# EAGLE design centralBoard (EAGLE 8.4.1)
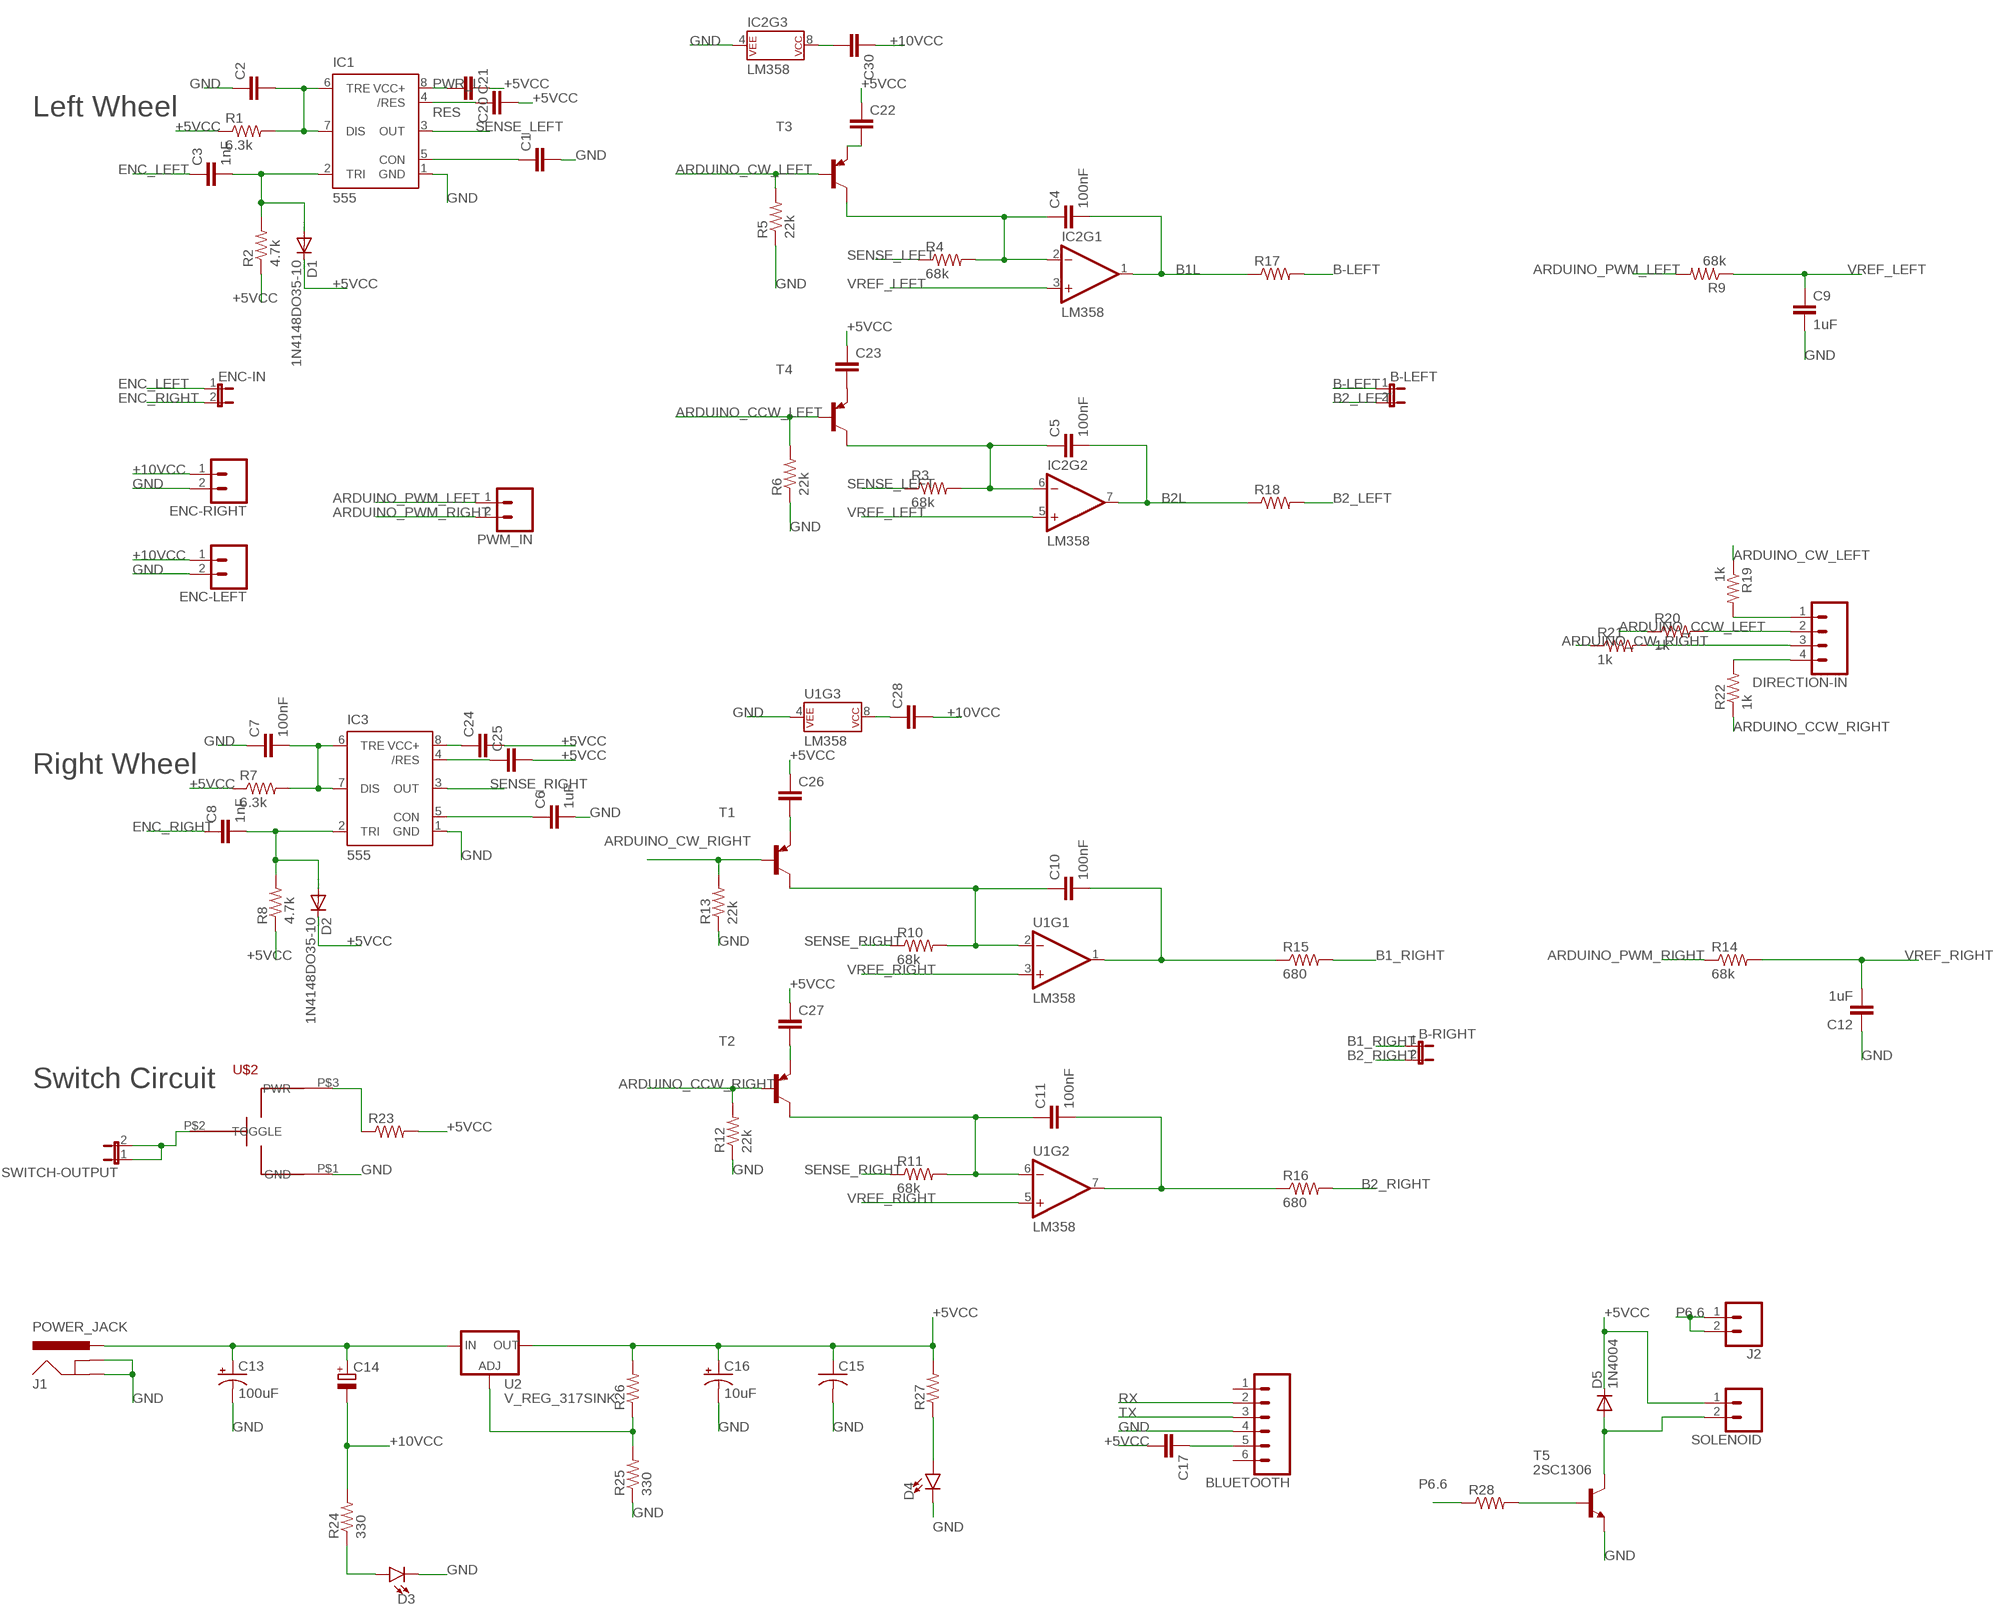
[diagram p0: schematic, sheet 1]

## Parts
B-LEFT  JUMPER-2PTH  [1X02]
B-RIGHT  JUMPER-2PTH  [1X02]
BLUETOOTH  CONN_06SILK_FEMALE_PTH  [1X06]
C1  C5/2.5  [C5B2.5]
C2  C5/2.5  [C5B2.5]
C3  1nF  C5/2.5  [C5B2.5]
C4  100nF  C5/2.5  [C5B2.5]
C5  100nF  C5/2.5  [C5B2.5]
C6  1uF  C5/2.5  [C5B2.5]
C7  100nF  C5/2.5  [C5B2.5]
C8  1nF  C5/2.5  [C5B2.5]
C9  1uF  C5/2.5  [C5B2.5]
C10  100nF  C5/2.5  [C5B2.5]
C11  100nF  C5/2.5  [C5B2.5]
C12  1uF  C5/2.5  [C5B2.5]
C13  100uF  100UF-POLAR-RADIAL-2.5MM-25V-20%  [CPOL-RADIAL-2.5MM-6.5MM]
C14  CPOL-EUE5-6  [E5-6]
C15  C-US050-030X075  [C050-030X075]
C16  10uF  10UF-POLAR-RADIAL-2.5MM-25V-20%  [CPOL-RADIAL-2.5MM-5MM]
C17  C5/3  [C5B3]
C20  C5/2.5  [C5B2.5]
C21  C5/2.5  [C5B2.5]
C22  C5/2.5  [C5B2.5]
C23  C5/2.5  [C5B2.5]
C24  C5/2.5  [C5B2.5]
C25  C5/2.5  [C5B2.5]
C26  C5/2.5  [C5B2.5]
C27  C5/2.5  [C5B2.5]
C28  C5/2.5  [C5B2.5]
C30  C5/2.5  [C5B2.5]
D1  1N4148DO35-10  [DO35-10]
D2  1N4148DO35-10  [DO35-10]
D3  LED-RED1206  [LED-1206]
D4  LED-RED1206  [LED-1206]
D5  1N4004  [DO41-10]
DIRECTION-IN  CONN_04  [1X04]
ENC-IN  JUMPER-2PTH  [1X02]
ENC-LEFT  CONN_02  [1X02]
ENC-RIGHT  CONN_02  [1X02]
IC1  555  555KIT  [DIP08-KIT]
IC2  LM358  [DIP08]
IC3  555  555KIT  [DIP08-KIT]
J1  POWER_JACK  [POWER_JACK_PTH]
J2  CONN_02  [1X02]
PWM_IN  CONN_02LOCK  [1X02_LOCK]
R1  6.3k  R-US_0207/10  [0207/10]
R2  4.7k  R-US_0207/10  [0207/10]
R3  68k  R-US_0207/10  [0207/10]
R4  68k  R-US_0207/10  [0207/10]
R5  22k  R-US_0207/10  [0207/10]
R6  22k  R-US_0207/10  [0207/10]
R7  6.3k  R-US_0207/10  [0207/10]
R8  4.7k  R-US_0207/10  [0207/10]
R9  68k  R-US_0207/10  [0207/10]
R10  68k  R-US_0207/10  [0207/10]
R11  68k  R-US_0207/10  [0207/10]
R12  22k  R-US_0207/10  [0207/10]
R13  22k  R-US_0207/10  [0207/10]
R14  68k  R-US_0207/10  [0207/10]
R15  680  R-US_0207/10  [0207/10]
R16  680  R-US_0207/10  [0207/10]
R17  R-US_0207/10  [0207/10]
R18  R-US_0207/10  [0207/10]
R19  1k  R-US_0207/10  [0207/10]
R20  1k  R-US_0207/10  [0207/10]
R21  1k  R-US_0207/10  [0207/10]
R22  1k  R-US_0207/10  [0207/10]
R23  R-US_0207/10  [0207/10]
R24  330  R-US_0207/10  [0207/10]
R25  330  R-US_0207/10  [0207/10]
R26  R-US_0207/10  [0207/10]
R27  R-US_0207/10  [0207/10]
R28  R-US_0207/10  [0207/10]
SOLENOID  CONN_02  [1X02]
SWITCH-OUTPUT  JUMPER-2PTH  [1X02]
T1  2N4126-PNP-TO92-CBE  [TO92-CBE]
T2  2N4126-PNP-TO92-CBE  [TO92-CBE]
T3  2N4126-PNP-TO92-CBE  [TO92-CBE]
T4  2N4126-PNP-TO92-CBE  [TO92-CBE]
T5  2SC1306  [TO220BV]
U1  LM358  [DIP08]
U2  V_REG_317SINK  [TO220-ADJ]
U$2  SWITCH  [SWITCH]

## Nets
+5VCC: C15.1 C16.1(+) C17.2 C20.1 C21.2 C22.1 C23.1 C24.2 C25.2 C26.1 C27.1 D1.C D2.C D5.C R1.1 R2.1 R7.1 R8.1 R23.2 R26.2 R27.2 SOLENOID.1 U2.OUT
+10VCC: C14.- C28.2 C30.1 ENC-LEFT.1 ENC-RIGHT.1 R24.2
ARDUINO_CCW_LEFT: R6.2 R20.1 T4.B
ARDUINO_CCW_RIGHT: R12.2 R22.1 T2.B
ARDUINO_CW_LEFT: R5.2 R19.1 T3.B
ARDUINO_CW_RIGHT: R13.2 R21.1 T1.B
ARDUINO_PWM_LEFT: PWM_IN.1 R9.2
ARDUINO_PWM_RIGHT: PWM_IN.2 R14.1
B1_RIGHT: B-RIGHT.1 R15.2
B1L: C4.2 IC2.1(OUT) R17.1
B1R: C10.2 R15.1 U1.1(OUT)
B2_LEFT: B-LEFT.2 R18.2
B2_RIGHT: B-RIGHT.2 R16.2
B2L: C5.2 IC2.7(OUT) R18.1
B2R: C11.2 R16.1 U1.7(OUT)
B-LEFT: B-LEFT.1 R17.2
ENC_LEFT: C3.1 ENC-IN.1
ENC_RIGHT: C8.1 ENC-IN.2
GND: BLUETOOTH.4 C1.2 C2.1 C6.2 C7.1 C9.2 C12.1 C13.2(-) C15.2 C16.2(-) D3.C D4.C ENC-LEFT.2 ENC-RIGHT.2 IC1.1(GND) IC2.4(P$V-) IC3.1(GND) J1.GND J1.GNDBREAK R5.1 R6.1 R12.1 R13.1 R25.1 T5.3(E) U1.4(P$V-) U$2.P$1(GND)
N$1: C1.1 IC1.5(CON)
N$2: C22.2 T3.E
N$3: C4.1 IC2.2(-IN) R4.2 T3.C
N$4: C2.2 IC1.6(TRE) IC1.7(DIS) R1.2
N$5: C23.2 T4.E
N$6: C5.1 IC2.6(-IN) R3.2 T4.C
N$7: C3.2 D1.A IC1.2(TRI) R2.2
N$8: C10.1 R10.2 T1.C U1.2(-IN)
N$9: C24.1 IC3.8(VCC+)
N$10: C26.2 T1.E
N$11: C6.1 IC3.5(CON)
N$12: C7.2 IC3.6(TRE) IC3.7(DIS) R7.2
N$13: C8.2 D2.A IC3.2(TRI) R8.2
N$14: C11.1 R11.2 T2.C U1.6(-IN)
N$15: C30.2 IC2.8(P$V+)
N$16: DIRECTION-IN.1 R19.2
N$17: DIRECTION-IN.2 R20.2
N$18: DIRECTION-IN.3 R21.2
N$19: DIRECTION-IN.4 R22.2
N$20: C27.2 T2.E
N$21: C25.1 IC3.4(/RES)
N$22: C13.1(+) C14.+ J1.PWR U2.IN
N$23: R23.1 U$2.P$3(PWR)
N$24: C28.1 U1.8(P$V+)
N$25: D4.A R27.1
N$26: R25.2 R26.1 U2.ADJ
N$27: SWITCH-OUTPUT.1 SWITCH-OUTPUT.2 U$2.P$2(TOGGLE)
N$28: D3.A R24.1
N$29: BLUETOOTH.5 C17.1
N$30: R28.2 T5.1(B)
N$32: D5.A SOLENOID.2 T5.2(C)
P6.6: J2.1 J2.2 R28.1
PWR_L: C20.2 IC1.8(VCC+)
RES: C21.1 IC1.4(/RES)
RX: BLUETOOTH.2
SENSE_LEFT: IC1.3(OUT) R3.1 R4.1
SENSE_RIGHT: IC3.3(OUT) R10.1 R11.1
TX: BLUETOOTH.3
VREF_LEFT: C9.1 IC2.3(+IN) IC2.5(+IN) R9.1
VREF_RIGHT: C12.2 R14.2 U1.3(+IN) U1.5(+IN)
Unconnected: BLUETOOTH.1 BLUETOOTH.6

## Notes on the sheet
- Left Wheel
- Right Wheel
- Switch Circuit

## Library data of the parts
B-LEFT B-RIGHT ENC-IN SWITCH-OUTPUT = SparkFun-Retired:JUMPER-2: Jumper Basic 0.1" spaced jumper. Use with breakaway headers.
BLUETOOTH = SparkFun-Connectors:CONN_06: Multi connection point. Often used as Generic Header-pin footprint for 0.1 inch spaced/style header connections On any of the 0.1 inch spaced packages, you can populate with these: Break Away Headers - Straight <https://www.sparkfun.com/products/116> (PRT-00116) Break Away Male Headers - Right Angle <https://www.sparkfun.com/products/553> (PRT-00553) Female Headers <https://www.sparkfun.com/products/115> (PRT-00115) Break Away Headers - Machine Pin <https://www.sparkfun.com/products/117> (PRT-00117) Break Away Female Headers - Swiss Machine Pin <https://www.sparkfun.com/products/743> (PRT-00743) Arduino Stackable Header - 6 Pin <https://www.sparkfun.com/products/9280> (PRT-09280) For SCREWTERMINALS and SPRING TERMINALS visit here: Screw Terimnals on SparkFun.com <https://www.sparkfun.com/search/results?term=Screw+Terminals> (5mm/3.5mm/2.54mm spacing) This device is also useful as a general connection point to wire up your design to another part of your project. Our various solder wires solder well into these plated through hole pads. Hook-Up Wire - Assortment (Stranded, 22 AWG) <https://www.sparkfun.com/products/11375> (PRT-11375) Hook-Up Wire - Assortment (Solid Core, 22 AWG) <https://www.sparkfun.com/products/11367> (PRT-11367) View the entire wire category on our website here <https://www.sparkfun.com/categories/141>; PROD_ID: CONN-08437
C1-C12 C17 C20-C28 C30 = capacitor-wima:C: CAPACITOR naming: grid - package width
C13 = SparkFun-Capacitors:100UF-POLAR: 100µF polarized capacitors A capacitor is a passive two-terminal electrical component used to store electrical energy temporarily in an electric field.; PROD_ID: CAP-08439
C14 = resistor:CPOL-EU: POLARIZED CAPACITOR, European symbol
C15 = resistor:C-US: CAPACITOR, American symbol
C16 = SparkFun-Capacitors:10UF-POLAR: 10.0µF polarized capacitors A capacitor is a passive two-terminal electrical component used to store electrical energy temporarily in an electric field.; PROD_ID: CAP-08440
D1 D2 = diode:1N4148: DIODE high speed (Philips)
D3 D4 = SparkFun-LED:LED-RED: Red SMD LED Used in manufacturing of most products at SparkFun Packages: 0603 - SMD 0603 package [Product Link] <http://docs.avagotech.com/docs/AV02-0551EN> 0603 SMART - SMD 0603 SMART package ( more efficient and expensive)[Product Link] <http://www.osram-os.com/Graphics/XPic2/00077099_0.pdf> 1206 - SMD1206 package [Product Link] <https://www.sparkfun.com/datasheets/DevTools/LilyPad/Q150OVS4.pdff> SparkFun Products: Pro Mini 328 -5V <https://www.sparkfun.com/products/821> RedBoard <https://www.sparkfun.com/products/12757> IOIO-OTG <https://www.sparkfun.com/products/13613>; PROD_ID: DIO-09912; VALUE: RED
D5 = adafruit:1N4004: DIODE General purpose 1N400x type rectifier (With bigger pads) http://www.ladyada.net/library/pcb/eaglelibrary.html
DIRECTION-IN = SparkFun-Connectors:CONN_04: Multi connection point. Often used as Generic Header-pin footprint for 0.1 inch spaced/style header connections On any of the 0.1 inch spaced packages, you can populate with these: Break Away Headers - Straight <https://www.sparkfun.com/products/116> (PRT-00116) Break Away Male Headers - Right Angle <https://www.sparkfun.com/products/553> (PRT-00553) Female Headers <https://www.sparkfun.com/products/115> (PRT-00115) Break Away Headers - Machine Pin <https://www.sparkfun.com/products/117> (PRT-00117) Break Away Female Headers - Swiss Machine Pin <https://www.sparkfun.com/products/743> (PRT-00743) For SCREWTERMINALS and SPRING TERMINALS visit here: Screw Terimnals on SparkFun.com <https://www.sparkfun.com/search/results?term=Screw+Terminals> (5mm/3.5mm/2.54mm spacing) This device is also useful as a general connection point to wire up your design to another part of your project. Our various solder wires solder well into these plated through hole pads. Hook-Up Wire - Assortment (Stranded, 22 AWG) <https://www.sparkfun.com/products/11375> (PRT-11375) Hook-Up Wire - Assortment (Solid Core, 22 AWG) <https://www.sparkfun.com/products/11367> (PRT-11367) View the entire wire category on our website here <https://www.sparkfun.com/categories/141> Special notes: Molex polarized connector foot print use with SKU : PRT-08231 with associated crimp pins and housings. 1MM SMD Version SKU: PRT-10208; PROD_ID: CONN-09696
ENC-LEFT ENC-RIGHT J2 PWM_IN SOLENOID = SparkFun-Connectors:CONN_02: Multi connection point. Often used as Generic Header-pin footprint for 0.1 inch spaced/style header connections On any of the 0.1 inch spaced packages, you can populate with these: Break Away Headers - Straight <https://www.sparkfun.com/products/116> (PRT-00116) Break Away Male Headers - Right Angle <https://www.sparkfun.com/products/553> (PRT-00553) Female Headers <https://www.sparkfun.com/products/115> (PRT-00115) Break Away Headers - Machine Pin <https://www.sparkfun.com/products/117> (PRT-00117) Break Away Female Headers - Swiss Machine Pin <https://www.sparkfun.com/products/743> (PRT-00743) For SCREWTERMINALS and SPRING TERMINALS visit here: Screw Terimnals on SparkFun.com <https://www.sparkfun.com/search/results?term=Screw+Terminals> (5mm/3.5mm/2.54mm spacing) This device is also useful as a general connection point to wire up your design to another part of your project. Our various solder wires solder well into these plated through hole pads. Hook-Up Wire - Assortment (Stranded, 22 AWG) <https://www.sparkfun.com/products/11375> (PRT-11375) Hook-Up Wire - Assortment (Solid Core, 22 AWG) <https://www.sparkfun.com/products/11367> (PRT-11367) View the entire wire category on our website here <https://www.sparkfun.com/categories/141> Special notes: Molex polarized connector foot print use with: PRT-08233 with associated crimp pins and housings. 2.54_SCREWTERM for use with PRT-10571. 3.5mm Screw Terminal footprints for PRT-08084 5mm Screw Terminal footprints for use with PRT-08432
IC1 IC3 = SparkFun-IC-Special-Function:555: General purpose bipolar Timer Datasheet <http://www.sparkfun.com/datasheets/Components/General/ne555.pdf> SparkFun Products SparkFun SparkPunk Sequencer Kit <https://www.sparkfun.com/products/12707> (KIT-12707) Storefront Component: 555 Timer <https://www.sparkfun.com/products/9273> (COM-09273) Two parts valid for production: VFP: IC-11930 (M7555 PTH) VFP: IC-09173 (555 PTH) - Preferred; PROD_ID: IC-09173; PROD_ID_ALT: IC-11930
IC2 U1 = SparkFun-IC-Amplifiers:LM358: LM358 Jellybean op-amp Datasheet <http://www.sparkfun.com/datasheets/Components/General/LM358.pdf> SparkFun Products Op-Amp (Thru-Hole) - LM358 <https://www.sparkfun.com/products/9456> (COM-09456); PROD_ID: IC-09172
J1 = SparkFun-Connectors:POWER_JACK: Power Jack Connector This is the standard 5.5mm barrel jack for power. The PTH is the most common, proven, reliable, footprint. The Slot footprint only works if the mill layer is transmitted to the PCB fab house so be warned. Here are the connectors we sell at SparkFun: DC Barrel Power Jack/Connector <https://www.sparkfun.com/products/119> (PRT-00119) DC Barrel Power Jack/Connector (SMD) <https://www.sparkfun.com/products/12748> (PRT-12748) DC Barrel Jack Adapter - Breadboard Compatible <https://www.sparkfun.com/products/10811> (PRT-10811) It is used on this SparkFun product (and many, many others): SparkFun RedBoard - Programmed with Arduino <https://www.sparkfun.com/products/12757> (DEV-12757) Also, if you need a mating power supply or connector, please check these out: Wall Adapter Power Supply - 9VDC 650mA <https://www.sparkfun.com/products/298> (TOL-00298) DC Barrel Jack Adapter - Male <https://www.sparkfun.com/products/10287> (PRT-10287); PROD_ID: CONN-08197
R1-R28 = resistor:R-US_: RESISTOR, American symbol
T1-T4 = transistor:*-PNP-: PNP Transistror
T5 = transistor:2SC1306: NPN Transistor Final RF Power Outupt Source: 2sc1306.pdf
U2 = SparkFun-IC-Power:V_REG_317: Voltage Regulator Standard LM317 adjustable voltage regulator. AOI (Adjust Output Input). Google 'LM317 Calculator' for easy to use app to get the two resistor values needed. 240/720 for 5V output. 240/390 for 3.3V output. Spark Fun Electronics SKU : COM-00527
U$2 = mySwitch:SWITCH

## Board
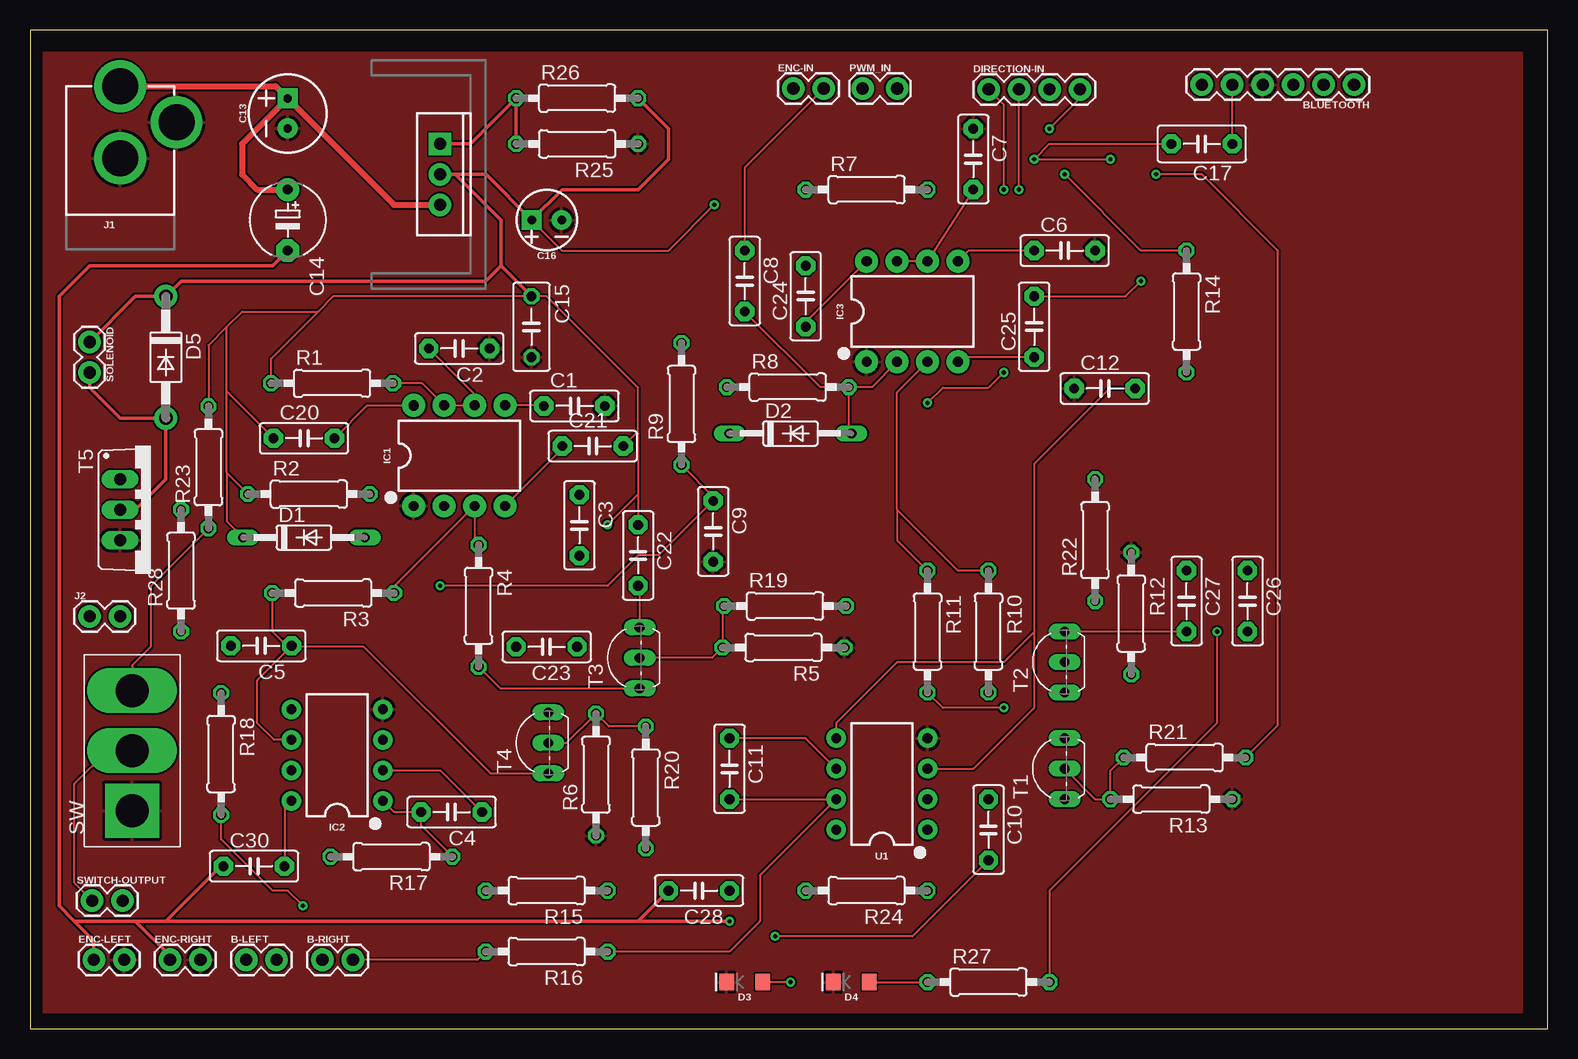
[diagram p1: board, top side]
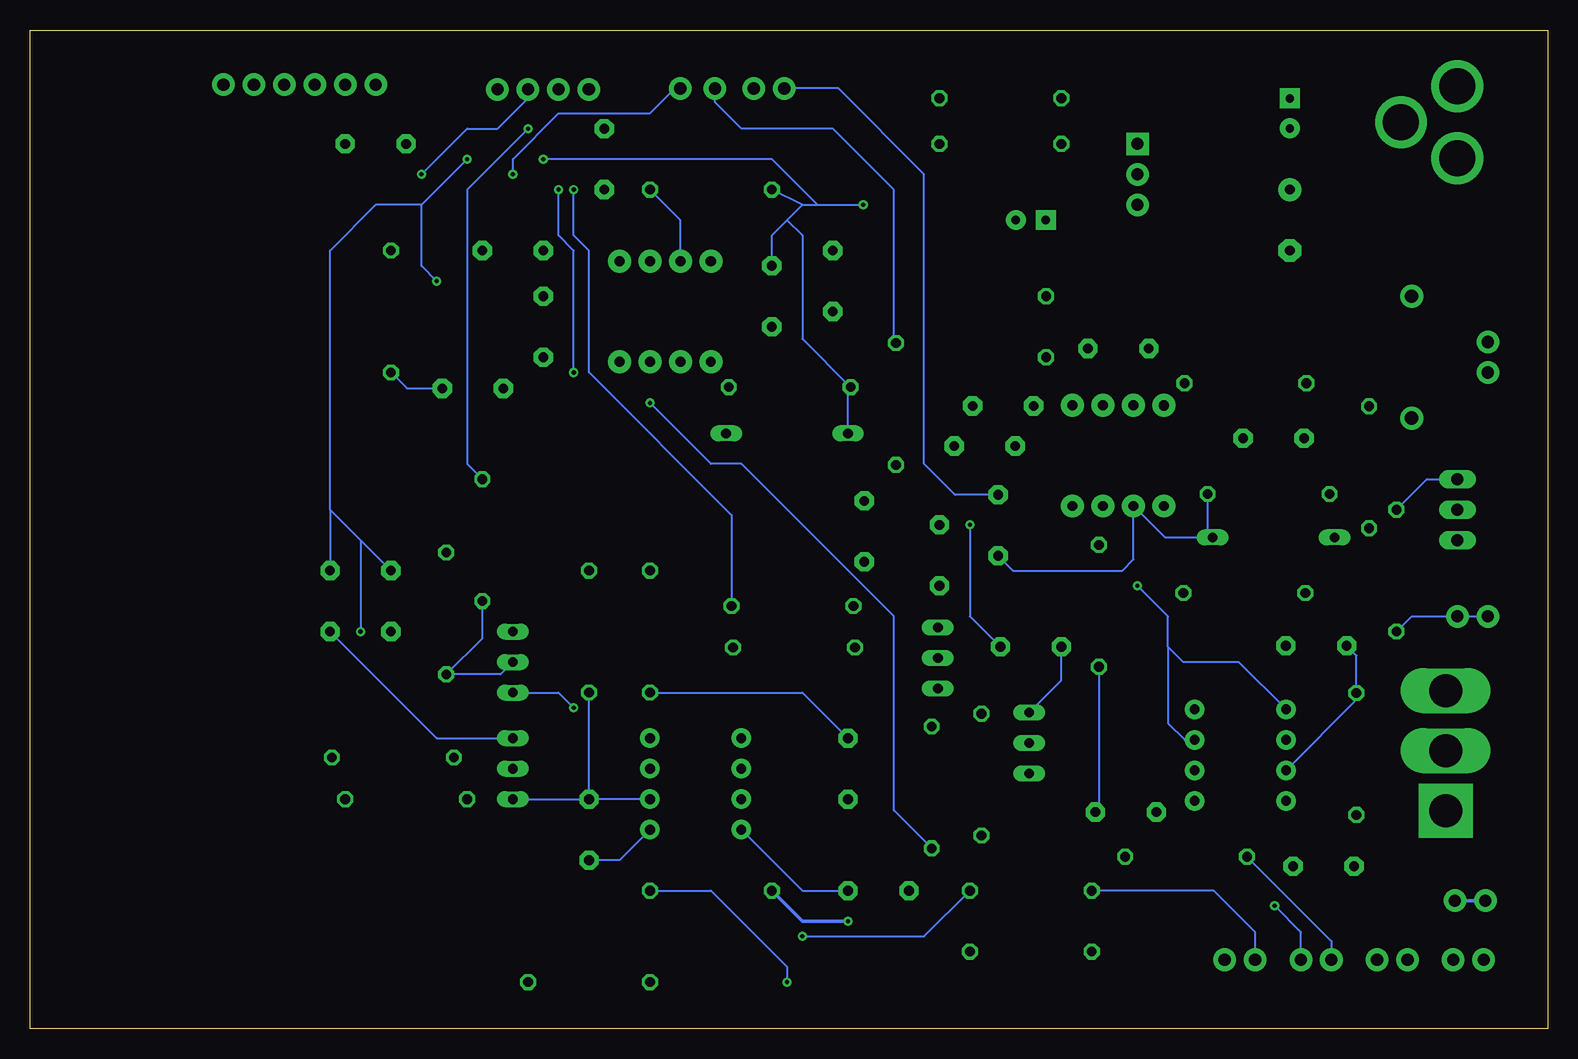
[diagram p2: board, bottom side, seen from below]

Size 126.5 x 83.24 mm. Coordinates in mm from the lower left corner, seen from the top.
Outline: 0,0 126.5,0 126.5,83.24 0,83.24 0,0
Copper layers (1*16): Top 0.035mm / dielectric 1.5mm / Bottom 0.035mm
Design rules "default": minimum track width 6mil, minimum drill 0.35mm, track to track 6mil, track to pad 6mil, pad to pad 6mil, via to via 6mil, smd to smd 6mil, copper to edge 40mil, drill to drill 6mil, minimum pad ring 10mil, minimum via ring 8mil, stop-mask expansion 4mil, vias tented up to drill 0mil, thermal gap 10mil

### Footprints (pad centres in the part's own frame; a part is rotated, then mirrored left to right if it is on the bottom)
1X02 = drill 1.016 pad 1.88: 1 0,0; 2 2.54,0
1X06 = drill 1.016 pad 1.88: 1 0,0; 2 2.54,0; 3 5.08,0; 4 7.62,0; 5 10.16,0; 6 12.7,0
C5B2.5 = drill 0.813 pad 1.6 octagon: 1 -2.54,0; 2 2.54,0
CPOL-RADIAL-2.5MM-6.5MM = drill 0.7 pad 1.651 square: 1 1.25,0 | drill 0.7 pad 1.651: 2 -1.25,0
E5-6 = drill 0.813 pad 1.905: + -2.54,0 | drill 0.813 pad 1.905 octagon: - 2.54,0
C050-030X075 = drill 0.813 octagon: 1 -2.54,0; 2 2.54,0
CPOL-RADIAL-2.5MM-5MM = drill 0.7 pad 1.651 square: 1 1.25,0 | drill 0.7 pad 1.651: 2 -1.25,0
C5B3 = drill 0.813 pad 1.6 octagon: 1 -2.54,0; 2 2.54,0
DO35-10 = drill 0.813 long: A 5.08,0; C -5.08,0
LED-1206 = smd 1.2 x 1.4: A -1.5,0; C 1.5,0
DO41-10 = drill 1.118 pad 1.93: A 5.08,0; C -5.08,0
1X04 = drill 1.016 pad 1.88: 1 0,0; 2 2.54,0; 3 5.08,0; 4 7.62,0
DIP08-KIT = drill 0.813 pad 1.905: 1 -3.81,-4.191; 2 -1.27,-4.191; 3 1.27,-4.191; 4 3.81,-4.191; 5 3.81,4.191; 6 1.27,4.191; 7 -1.27,4.191 | drill 0.864 pad 1.905: 8 -3.81,4.191
DIP08 = drill 0.813 pad 1.626: 1 -3.81,-3.81; 2 -1.27,-3.81; 3 1.27,-3.81; 4 3.81,-3.81; 5 3.81,3.81; 6 1.27,3.81; 7 -1.27,3.81; 8 -3.81,3.81
POWER_JACK_PTH = drill 2.997 pad 4.318: GND 0,7.7; GNDBREAK 4.7,10.7; PWR 0,13.7
1X02_LOCK = drill 1.016 pad 1.88: 1 -0.178,0; 2 2.718,0
0207/10 = drill 0.813 octagon: 1 -5.08,0; 2 5.08,0
TO92-CBE = drill 0.813 long: B 0,0; C -2.54,0; E 2.54,0
TO220BV = drill 1.016 long: 1 -2.54,-2.54; 2 0,-2.54; 3 2.54,-2.54
TO220-ADJ = drill 1 pad 1.88 square: ADJ -2.54,0 | drill 1 pad 1.88: IN 2.54,0; OUT 0,0
SWITCH = drill 2.75 pad 4.5 square: P$1 -13.57,3.23 | drill 2.75 pad 3.25 long: P$2 -8.57,3.23; P$3 -3.57,3.23

### Placement (x,y rotation side)
B-LEFT  18.02,5.76 0 top
B-RIGHT  24.37,5.76 0 top
BLUETOOTH  110.38,78.69 180 top
C1  45.38,51.91 0 top
C2  35.78,56.7 180 top
C3  45.8,41.97 270 top
C4  35.14,18.07 180 top
C5  19.28,31.92 180 top
C6  86.25,64.86 0 top
C7  78.63,72.48 270 top
C8  59.58,62.32 270 top
C9  56.95,41.46 270 top
C10  79.9,16.6 270 top
C11  58.31,21.68 270 top
C12  89.59,53.37 0 top
C13  21.48,76.29 90 top
C14  21.48,67.4 270 top
C15  41.8,58.51 270 top
C16  43.07,67.4 180 top
C17  97.68,73.75 180 top
C20  22.84,49.22 0 top
C21  46.91,48.57 0 top
C22  50.69,39.46 270 top
C23  43.07,31.84 180 top
C24  64.66,61.05 90 top
C25  83.71,58.51 90 top
C26  101.49,35.65 270 top
C27  96.41,35.65 270 top
C28  55.77,11.52 180 top
C30  18.67,13.56 0 top
D1  22.83,40.95 0 top
D2  63.39,49.62 0 top
D3  59.58,3.9 180 top
D4  68.47,3.9 180 top
D5  11.32,55.97 270 top
DIRECTION-IN  79.91,78.29 0 top
ENC-IN  63.63,78.37 0 top
ENC-LEFT  5.32,5.76 0 top
ENC-RIGHT  11.67,5.76 0 top
IC1  35.79,47.77 0 top
IC2  25.6,22.82 90 top
IC3  73.55,59.78 0 top
J1  7.51,64.86 0 top
J2  4.97,34.38 0 top
PWM_IN  69.58,78.37 0 top
R1  25.18,53.8 0 top
R2  23.25,44.57 0 top
R3  25.27,36.32 180 top
R4  37.39,35.25 270 top
R5  62.81,31.78 180 top
R6  47.18,21.19 90 top
R7  69.74,69.94 0 top
R8  63.17,53.48 0 top
R9  54.31,52.08 90 top
R10  79.9,33.11 270 top
R11  74.82,33.11 270 top
R12  91.8,34.62 270 top
R13  95.14,19.14 180 top
R14  96.41,59.78 270 top
R15  43.07,11.52 180 top
R16  43.07,6.44 180 top
R17  30.13,14.35 180 top
R18  15.93,22.91 270 top
R19  62.94,35.24 0 top
R20  51.33,20.12 270 top
R21  96.25,22.61 0 top
R22  88.79,40.73 90 top
R23  14.88,46.8 90 top
R24  69.74,11.52 180 top
R25  45.61,73.75 180 top
R26  45.61,77.56 0 top
R27  79.9,3.9 0 top
R28  12.59,38.19 90 top
SOLENOID  4.97,57.24 270 top
SWITCH-OUTPUT  5.18,10.68 0 top
T1  86.25,21.68 90 top
T2  86.25,30.57 90 top
T3  50.82,30.91 90 top
T4  43.2,23.83 90 top
T5  10.05,43.27 270 top
U1  71.01,20.41 90 top
U2  34.18,71.21 270 top
U$2  11.73,31.75 90 top

### Tracks (layer width: path | path; a pad name or v marks a point on that pad's centre or on a via)
+5VCC  (via drill 0.35)
  Top 0.152: 16.4,58.51 17.67,59.78 24.02,59.78 | R1.1 20.1,55.86 24.02,59.78 | 50.69,49.62 50.69,53.43 43.07,61.05 C15.1 25.29,61.05 24.02,59.78 | 50.69,49.62 50.69,44.54 | 50.69,44.54 C22.1 | C21.2 50.5,49.62 50.69,49.62 | 50.69,44.54 v48.15,42 | C16.1 44.36,64.86 53.23,64.86 v57.04,68.67 | C17.2 84.98,73.75 v83.71,72.48 v90.06,72.48 | C25.2 91.33,61.05 v92.6,62.32 | D1.C 16.4,42.3 16.4,46.34 | 16.4,46.34 16.4,53.12 | 16.4,53.12 16.4,58.51 | R23.2 14.88,56.99 16.4,58.51 | C20.1 16.4,53.12 | R2.1 16.4,46.34 | v98.95,33.11 98.95,25.49 84.98,11.52 R27.2
  Top 0.305: R26.2 53.23,75.02 53.23,72.48 50.69,69.94 44.34,69.94 41.82,67.42 C16.1 38.01,71.21 U2.OUT 35.45,71.21 39.26,67.4 39.26,63.59 | 39.26,63.59 37.99,62.32 12.59,62.32 D5.C 8.78,61.05 SOLENOID.1 | C15.1 39.26,63.59
  Bottom 0.152: C23.1 48.15,34.38 v48.15,42 | 62.12,68.67 60.85,68.67 | 60.85,68.67 v57.04,68.67 | 62.12,68.67 R7.1 | C24.2 64.66,66.13 63.39,67.4 | 63.39,67.4 62.12,68.67 | 63.39,67.4 62.12,66.13 62.12,57.51 R8.1 58.31,53.26 D2.C | 60.85,68.67 64.66,72.48 v83.71,72.48 | 93.87,68.67 v90.06,72.48 | 93.87,68.67 97.68,68.67 101.49,64.86 101.49,43.27 | 101.49,43.27 C26.1 | C27.1 98.95,40.73 | 98.95,40.73 101.49,43.27 | v92.6,62.32 93.87,63.59 93.87,68.67 | 98.95,40.73 v98.95,33.11
+10VCC  (via drill 0.35)
  Top 0.305: C14.- 20.21,63.59 4.97,63.59 2.43,61.05 2.43,10.25 3.7,8.98 | 8.78,8.98 3.7,8.98 | 8.78,8.98 11.32,8.98 | 11.32,8.98 15.9,13.56 C30.1 | 3.7,8.98 5.32,7.36 ENC-LEFT.1 | ENC-RIGHT.1 11.67,6.09 8.78,8.98 | 11.32,8.98 50.69,8.98 | 50.69,8.98 C28.2 | 50.69,8.98 v58.31,8.98
  Bottom 0.305: v58.31,8.98 62.12,8.98 R24.2
ARDUINO_CCW_LEFT
  Top 0.152: R20.1 48.25,25.2 R6.2 44.74,23.83 T4.B
ARDUINO_CCW_RIGHT
  Bottom 0.152: R22.1 88.79,32.55 R12.2 87.28,29.54 T2.B
ARDUINO_CW_LEFT
  Top 0.152: R19.1 57.73,35.11 R5.2 56.86,30.91 T3.B
ARDUINO_CW_RIGHT
  Top 0.152: R21.1 90.06,21.5 R13.2 88.79,19.14 T1.B
ARDUINO_PWM_LEFT
  Bottom 0.152: R9.2 54.5,57.35 54.5,69.94 59.58,75.02 67.2,75.02 69.4,77.22 PWM_IN.1
ARDUINO_PWM_RIGHT  (via drill 0.35)
  Top 0.152: R14.1 92.6,64.86 v86.25,71.21
  Bottom 0.152: v86.25,71.21 86.25,72.48 82.44,76.29 74.82,76.29 72.74,78.37 PWM_IN.2
B1_RIGHT
  Bottom 0.152: B-RIGHT.1 24.37,8.06 27.83,11.52 R15.2
B1L
  Top 0.152: IC2.1 30.35,18.07 C4.2 32.6,16.96 R17.1
B1R  (via drill 0.35)
  Top 0.152: C10.2 73.55,7.71 v62.12,7.71
  Bottom 0.152: U1.1 77.36,14.06 C10.2 | v62.12,7.71 51.96,7.71 R15.1
B2_LEFT  (via drill 0.35)
  Top 0.152: v22.75,10.25 21.48,11.52 20.21,11.52 15.93,15.8 R18.2
  Bottom 0.152: B-LEFT.2 20.56,8.06 v22.75,10.25
B2_RIGHT
  Top 0.152: R16.2 37.31,5.76 B-RIGHT.2
B2L
  Bottom 0.152: C5.2 15.93,31.11 R18.1 15.93,27.41 IC2.7
B2R
  Top 0.152: C11.2 U1.7 60.85,12.79 60.85,8.98 58.31,6.44 R16.1
B-LEFT
  Bottom 0.152: R17.2 18.02,7.32 B-LEFT.1
ENC_LEFT
  Bottom 0.152: C3.1 49.39,44.51 51.96,47.08 51.96,71.21 59.12,78.37 ENC-IN.1
ENC_RIGHT
  Top 0.152: ENC-IN.2 59.58,71.78 C8.1
GND
  pour Top: 2.43,81.37 124.35,81.37 124.35,1.36 1.16,1.36 1.16,81.37
N$1
  Top 0.152: C1.1 42.79,51.96 IC1.5
N$2
  Top 0.152: C22.2 50.82,36.79 T3.E
N$3
  Top 0.152: R4.2 39.19,28.37 T3.C | IC2.2 34.2,21.55 C4.1
  Bottom 0.152: R4.2 37.39,18.36 C4.1
N$4
  Top 0.152: R1.2 32.68,53.8 IC1.7 IC1.6 37.06,52.88 C2.2
N$5
  Bottom 0.152: T4.E 40.53,29.04 C23.2
N$6
  Top 0.152: T4.C 38.38,21.29 27.83,31.84 21.9,31.84 C5.1 21.61,31.71 | IC2.6 20.34,24.09 18.94,25.49 18.94,29.04 21.61,31.71 | R3.2 20.19,33.13 21.61,31.71
N$7
  Bottom 0.152: C3.2 44.56,38.19 35.45,38.19 34.52,39.12 IC1.2 31.89,40.95 D1.A 28.33,41.37 R2.2
N$8
  Bottom 0.152: C10.1 R10.2 | T1.C C10.1 | U1.2 C10.1
N$9
  Top 0.152: IC3.8 64.66,58.89 C24.1
N$10
  Bottom 0.152: C26.2 92.6,24.22 T1.E
N$11
  Top 0.152: C6.1 78.25,64.86 IC3.5
N$12
  Top 0.152: C7.2 IC3.6 IC3.7
  Bottom 0.152: IC3.7 72.28,67.4 R7.2
N$13
  Top 0.152: C8.2 65.88,53.48 R8.2 | IC3.2 70.17,53.48 R8.2 | D2.A 68.25,49.84 R8.2
N$14  (via drill 0.35)
  Top 0.152: U1.6 64.66,24.22 C11.1 | v81.17,26.76 76.09,26.76 R11.2
  Bottom 0.152: C11.1 62.12,28.03 R11.2 | T2.C 82.44,28.03 v81.17,26.76
N$15
  Top 0.152: IC2.8 21.21,18.43 C30.2
N$16  (via drill 0.35)
  Top 0.152: v81.17,69.94 81.17,77.03 DIRECTION-IN.1
  Bottom 0.152: R19.2 68.02,42.82 79.9,54.7 79.9,64.86 81.17,66.13 v81.17,69.94
N$17  (via drill 0.35)
  Top 0.152: v74.82,52.16 76.09,53.43 79.9,53.43 v81.17,54.7 | 82.45,77.57 DIRECTION-IN.2 v82.44,69.94
  Bottom 0.152: R20.2 54.5,18.21 54.5,34.38 67.2,47.08 69.74,47.08 v74.82,52.16 | v82.44,69.94 82.44,66.13 81.17,64.86 v81.17,54.7
N$18  (via drill 0.35)
  Top 0.152: R21.2 104.03,25.31 104.03,64.86 97.68,71.21 v93.87,71.21
  Bottom 0.152: v93.87,71.21 90.06,75.02 87.52,75.02 84.99,77.55 DIRECTION-IN.3
N$19  (via drill 0.35)
  Top 0.152: DIRECTION-IN.4 87.53,77.57 v84.98,75.02
  Bottom 0.152: R22.2 90.06,47.08 90.06,69.94 v84.98,75.02
N$20
  Top 0.152: C27.2 T2.E
N$21
  Top 0.152: C25.1 77.74,55.97 IC3.4
N$22
  Top 0.508: J1.PWR 20.46,78.56 C13.1 | C13.1 30.35,68.67 U2.IN | C13.1 17.69,73.75 17.67,73.75 17.67,71.21 18.94,69.94 C14.+
N$23
  Top 0.152: R23.1 10.05,36.89 10.05,31.84 8.5,30.29 U$2.P$3
N$24
  Bottom 0.152: U1.8 62.12,11.52 C28.1
N$25
  Top 0.152: D4.A R27.1
N$26
  Top 0.305: U2.ADJ 36.72,73.75 R26.1 R25.2
N$27
  Top 0.152: SWITCH-OUTPUT.1 3.7,12.16 3.7,20.41 6.47,23.18 U$2.P$2
  Bottom 0.305: SWITCH-OUTPUT.1 SWITCH-OUTPUT.2
N$28  (via drill 0.35)
  Top 0.152: v63.39,3.9 D3.A
  Bottom 0.152: R24.1 69.74,11.52 63.39,5.17 v63.39,3.9
N$29
  Top 0.152: C17.1 BLUETOOTH.5
N$30
  Bottom 0.152: R28.2 10.05,45.81 T5.1
N$32
  Top 0.305: SOLENOID.2 4.97,53.43 7.51,50.89 D5.A 11.32,45.81 8.78,43.27 T5.2
P6.6
  Bottom 0.152: R28.1 11.32,34.38 J2.2 J2.1
PWR_L
  Top 0.152: C20.2 28.12,51.96 IC1.8
RES
  Top 0.152: IC1.4 44.37,48.35 C21.1
SENSE_LEFT
  Top 0.152: R3.1 30.35,36.87 IC1.3 37.06,40.66 R4.1
SENSE_RIGHT
  Top 0.152: IC3.3 72.28,53.05 72.28,43.27 | R11.1 72.28,40.73 72.28,43.27 | R10.1 77.36,38.19 72.28,43.27
VREF_LEFT  (via drill 0.35)
  Top 0.152: v34.18,36.92 48.15,36.92 50.69,39.46 52.41,39.46 C9.1 56.95,44.36 R9.1
  Bottom 0.152: v34.18,36.92 31.64,34.38 31.64,31.84 | 31.64,31.84 31.64,25.49 30.24,24.09 IC2.3 | IC2.5 25.73,30.57 30.37,30.57 31.64,31.84
VREF_RIGHT
  Top 0.152: U1.3 78.63,21.68 83.71,26.76 83.71,33.11 | 83.71,33.11 83.71,47.08 90,53.37 C12.2 | 83.71,33.11 81.17,30.57 72.28,30.57 67.2,25.49 U1.5
  Bottom 0.152: R14.2 95.08,53.37 C12.2